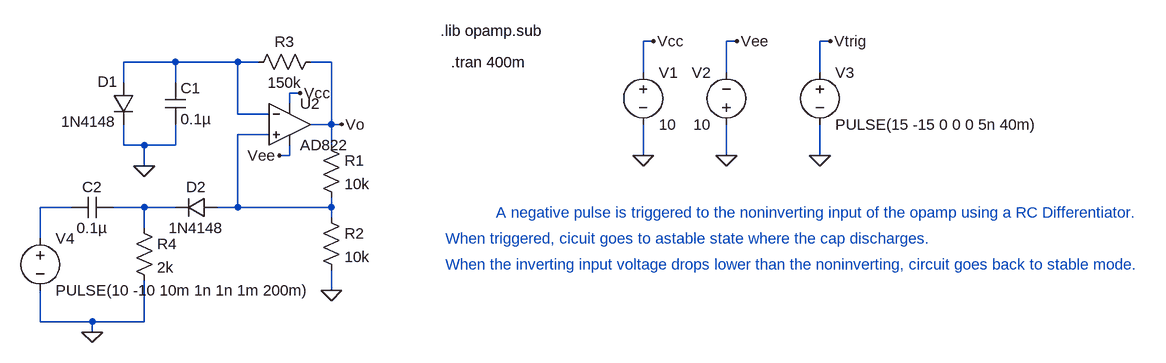
[diagram p0: schematic MonostableMultivibrator.asc]
MonostableMultivibrator.asc, the LTspice schematic file:
Version 4
SHEET 1 1712 680
WIRE 736 32 720 32
WIRE 864 32 848 32
WIRE 1008 32 992 32
WIRE 0 64 -80 64
WIRE 96 64 0 64
WIRE 128 64 96 64
WIRE 240 64 208 64
WIRE 720 80 720 32
WIRE 848 80 848 32
WIRE 992 80 992 32
WIRE -80 96 -80 64
WIRE 0 96 0 64
WIRE 192 112 176 112
WIRE 176 128 176 112
WIRE 96 144 96 64
WIRE 144 144 96 144
WIRE 240 160 240 64
WIRE 240 160 208 160
WIRE 256 160 240 160
WIRE 144 176 96 176
WIRE -80 192 -80 160
WIRE -48 192 -80 192
WIRE 0 192 0 160
WIRE 0 192 -48 192
WIRE 240 192 240 160
WIRE 176 208 176 192
WIRE 176 208 160 208
WIRE 720 208 720 160
WIRE 848 208 848 160
WIRE 992 208 992 160
WIRE -48 224 -48 192
WIRE -160 288 -208 288
WIRE -48 288 -96 288
WIRE 0 288 -48 288
WIRE 96 288 96 176
WIRE 96 288 64 288
WIRE 240 288 240 272
WIRE 240 288 96 288
WIRE 240 304 240 288
WIRE -48 320 -48 288
WIRE -208 336 -208 288
WIRE 240 416 240 384
WIRE -208 464 -208 416
WIRE -128 464 -208 464
WIRE -48 464 -48 400
WIRE -48 464 -128 464
WIRE -128 480 -128 464
FLAG 240 416 0
FLAG -48 224 0
FLAG 720 208 0
FLAG 848 208 0
FLAG 736 32 Vcc
FLAG 192 112 Vcc
FLAG 864 32 Vee
FLAG 160 208 Vee
FLAG 1008 32 Vtrig
FLAG 992 208 0
FLAG -128 480 0
FLAG 256 160 Vo
SYMBOL res 224 176 R0
SYMATTR InstName R1
SYMATTR Value 10k
SYMBOL res 224 288 R0
SYMATTR InstName R2
SYMATTR Value 10k
SYMBOL res 224 48 R90
WINDOW 0 0 56 VBottom 2
WINDOW 3 32 56 VTop 2
SYMATTR InstName R3
SYMATTR Value 150k
SYMBOL cap -16 96 R0
SYMATTR InstName C1
SYMATTR Value 0.1µ
SYMBOL diode -96 96 R0
WINDOW 0 -24 -2 Left 2
WINDOW 3 -80 60 Left 2
SYMATTR InstName D1
SYMATTR Value 1N4148
SYMBOL OpAmps\\AD822 176 96 R0
SYMATTR InstName U2
SYMBOL voltage 720 64 R0
SYMATTR InstName V1
SYMATTR Value 10
SYMBOL voltage 848 176 R180
WINDOW 0 24 96 Left 2
WINDOW 3 24 16 Left 2
SYMATTR InstName V2
SYMATTR Value 10
SYMBOL voltage 992 64 R0
WINDOW 123 0 0 Left 0
WINDOW 39 0 0 Left 0
SYMATTR InstName V3
SYMATTR Value PULSE(15 -15 0 0 0 5n 40m)
SYMBOL diode 64 272 R90
WINDOW 0 0 32 VBottom 2
WINDOW 3 32 32 VTop 2
SYMATTR InstName D2
SYMATTR Value 1N4148
SYMBOL res -64 304 R0
SYMATTR InstName R4
SYMATTR Value 2k
SYMBOL cap -96 272 R90
WINDOW 0 0 32 VBottom 2
WINDOW 3 32 32 VTop 2
SYMATTR InstName C2
SYMATTR Value 0.1µ
SYMBOL voltage -208 320 R0
WINDOW 123 0 0 Left 0
WINDOW 39 0 0 Left 0
SYMATTR InstName V4
SYMATTR Value PULSE(10 -10 10m 1n 1n 1m 200m)
TEXT 408 16 Left 2 !.lib opamp.sub
TEXT 424 64 Left 2 !.tran 400m
TEXT 992 296 Center 2 ;A negative pulse is triggered to the noninverting input of the opamp using a RC Differentiator.
TEXT 416 336 Left 2 ;When triggered, cicuit goes to astable state where the cap discharges.
TEXT 416 376 Left 2 ;When the inverting input voltage drops lower than the noninverting, circuit goes back to stable mode.

The netlist it stands for:
* MonostableMultivibrator.asc
R1 Vo N002 10k
R2 N002 0 10k
R3 Vo N001 150k
C1 N001 0 0.1µ
D1 N001 0 1N4148
XU2 N002 N001 Vcc Vee Vo AD822  ; pins In+ In- V+ V- OUT
V1 Vcc 0 10
V2 0 Vee 10
V3 Vtrig 0 PULSE(15 -15 0 0 0 5n 40m)
D2 N002 N004 1N4148
R4 N004 0 2k
C2 N004 N003 0.1µ
V4 N003 0 PULSE(10 -10 10m 1n 1n 1m 200m)
.model D D
.lib standard.dio
.lib opamp.sub
.tran 400m
* A negative pulse is triggered to the noninverting input of the opamp using a RC Differentiator.
* When triggered, cicuit goes to astable state where the cap discharges.
* When the inverting input voltage drops lower than the noninverting, circuit goes back to stable mode.
.backanno
.end